# Altium schematic sheet CAN_Tranceiver.SchDoc
size A
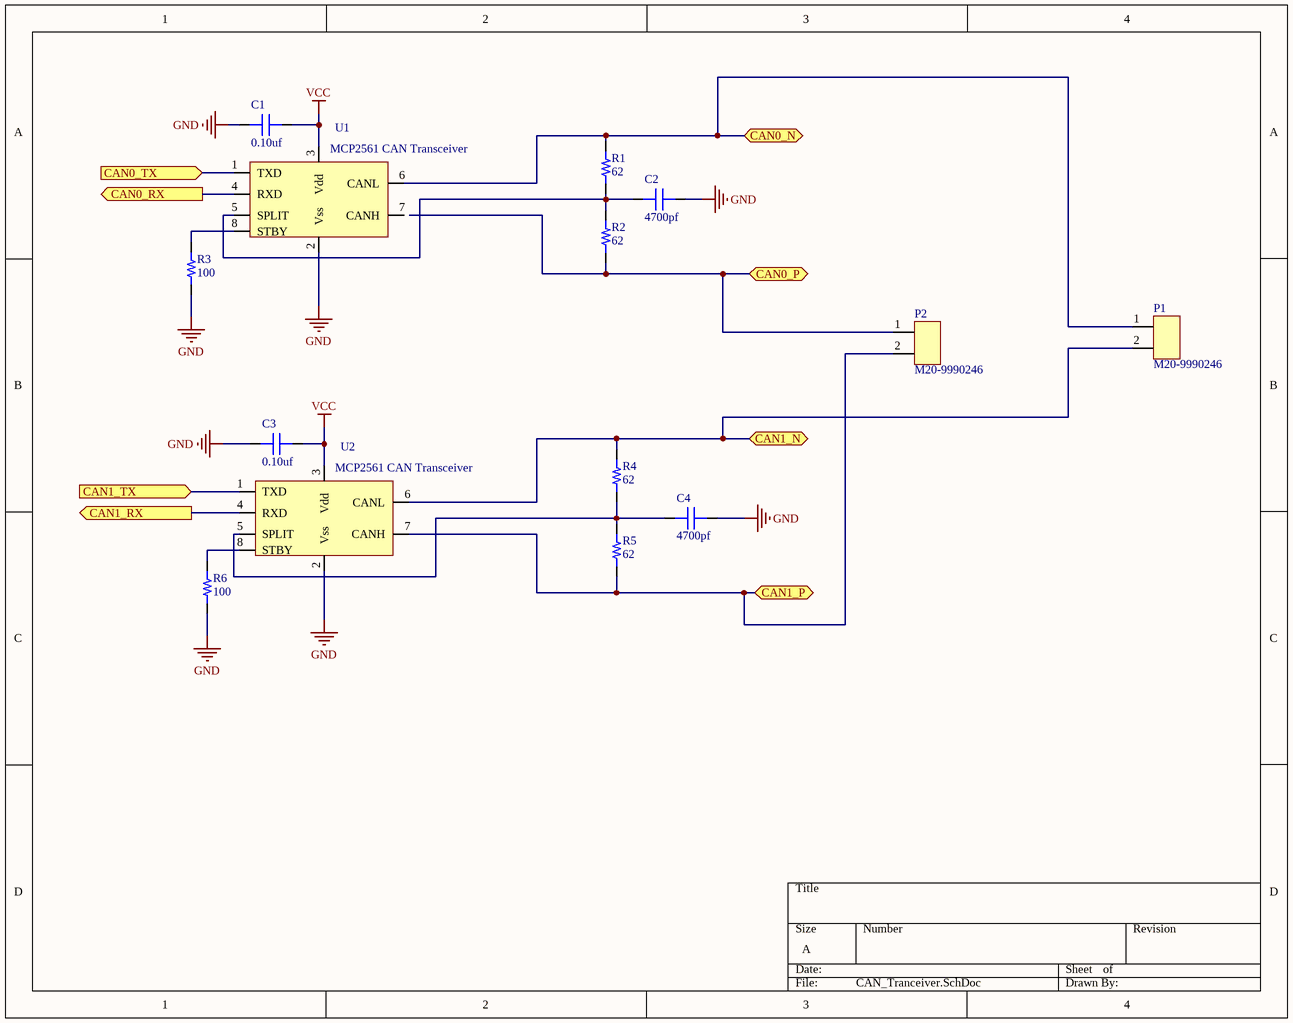
[diagram p0: CAN_Tranceiver.SchDoc]

## Parts
C1  value 0.10uf  [CAP 0603/1608]  (hidden comment: Capacitor MLCC 0.10uf 50V CAP 0603/1608)
C2  value 4700pf  [CAP 0603/1608]  (hidden comment: Capacitor MLCC 4700pf 50V CAP 0603/1608)
C3  value 0.10uf  [CAP 0603/1608]  (hidden comment: Capacitor MLCC 0.10uf 50V CAP 0603/1608)
C4  value 4700pf  [CAP 0603/1608]  (hidden comment: Capacitor MLCC 4700pf 50V CAP 0603/1608)
P1  M20-9990246  [M20-9990246]
P2  M20-9990246  [M20-9990246]
R1  value 62  [RES 0603/1608]  (hidden comment: Resistor 62 0603 1/10W 5%)
R2  value 62  [RES 0603/1608]  (hidden comment: Resistor 62 0603 1/10W 5%)
R3  value 100  [RES 0603/1608]  (hidden comment: Resistor 100 0603 1/10W 10%)
R4  value 62  [RES 0603/1608]  (hidden comment: Resistor 62 0603 1/10W 5%)
R5  value 62  [RES 0603/1608]  (hidden comment: Resistor 62 0603 1/10W 5%)
R6  value 100  [RES 0603/1608]  (hidden comment: Resistor 100 0603 1/10W 10%)
U1  MCP2561 CAN Transceiver  [SOIC-8]
U2  MCP2561 CAN Transceiver  [SOIC-8]

## Ports
CAN0_N (bidir), CAN0_P (bidir), CAN0_RX (out), CAN0_TX (in), CAN1_N (bidir), CAN1_P (bidir), CAN1_RX (out), CAN1_TX (in)

## Nets
GND: C1.1 C2.1 C3.1 C4.1 R3.1 R6.1 U1.2(Vss) U2.2(Vss)
VCC: C1.2 C3.2 U1.3(Vdd) U2.3(Vdd)
CAN0_N: P1.1 R1.1 U1.6(CANL) ; port CAN0_N
CAN0_P: P2.1 R2.2 ; port CAN0_P
CAN0_RX: U1.4(RXD) ; port CAN0_RX
CAN0_TX: U1.1(TXD) ; port CAN0_TX
CAN1_N: P1.2 R4.1 U2.6(CANL) ; port CAN1_N
CAN1_P: P2.2 R5.2 U2.7(CANH) ; port CAN1_P
CAN1_RX: U2.4(RXD) ; port CAN1_RX
CAN1_TX: U2.1(TXD) ; port CAN1_TX
NetC2_2: C2.2 R1.2 R2.1 U1.5(SPLIT)
NetC4_2: C4.2 R4.2 R5.1 U2.5(SPLIT)
NetR3_2: R3.2 U1.8(STBY)
NetR6_2: R6.2 U2.8(STBY)

Not connected (* = marked no-connect by the designer): U1 7(CANH)

## Library data of the parts
C1 C3 = 943: Manufacturer_id: 1; idCapacitor: 943; Name: Cap_0.10uf_50V_CAP 0603/1608; Dielectric: Ceramic; Created_By: Nick Mah; Drawer_id: 1; Voltage_Rating: 50V; Package: CAP 0603/1608; Created_Date: 10/20/2018
C2 C4 = 929: Manufacturer_id: 1; idCapacitor: 929; Name: Cap_4700pf_50V_CAP 0603/1608; Dielectric: Ceramic; Created_By: Nick Mah; Drawer_id: 1; Voltage_Rating: 50V; Package: CAP 0603/1608; Created_Date: 10/20/2018
P1 P2 = 25: 2 Pin VCC Power Header, Male; Manufacturer_id: 1; idConn: 25; Value: CONN; Voltage_Rating: Null; Num_Contacts: 2; Pitch: 2.54; Created_By: Austin; Drawer_id: 1; Name: M20-9990246; Num_Rows: Null; Package: Conn; MfrPartNo: M20-9990246; Link: https://www.digikey.com/product-detail/en/harwin-inc/M20-9990246/952-2262-ND/3728226; ComponentLink1Description: Null; ComponentLink1URL: https://www.digikey.com/product-detail/en/harwin-inc/M20-9990246/952-2262-ND/3728226; Supplier1: Digi-Key; Supplier1PartNo: 952-2262-ND; Created_Date: 12/15/2018; Updated_By: Null
R1 R2 R4 R5 = 1340: Manufacturer_id: 1; idResistor: 1340; Name: Res_62_0603_1/10W_5%; Created_By: Nick Mah; Supplier 1: Digi-Key; Drawer_id: 1; Tolerance: 5%; Power: 1/10W; Package: 0603; ComponentLink1Description: Datasheet; Created_Date: 2018-10-20
R3 R6 = 2293: Manufacturer_id: 1; idResistor: 2293; Name: Res_100_0603_1/10W_10%; Created_By: Nick Mah; Supplier 1: Digi-Key; Drawer_id: 1; Tolerance: 10%; Power: 1/10W; Package: 0603; ComponentLink1Description: Datasheet; Created_Date: 2018-10-20
U1 U2 = 5: Manufacturer_id: 1; idIC_Interface: 5; Value: CAN/UART; Data_Rate: 1Mbps; Vin(Min): 4.5V; Vin(Max): 5.5V; Created_By: Angel Delgado; Drawer_id: 1; Name: CAN Transceiver; Type: Transceiver; Protocol: CAN; Num_Circuits: 1; Package: SOIC-8; MfrPartNo: MCP2561; Link: https://www.digikey.com/product-detail/en/microchip-technology/MCP2561T-E-SN/MCP2561T-E-SNCT-ND/5148846